# EAGLE design XM125_Breakout (EAGLE 9.6.2)
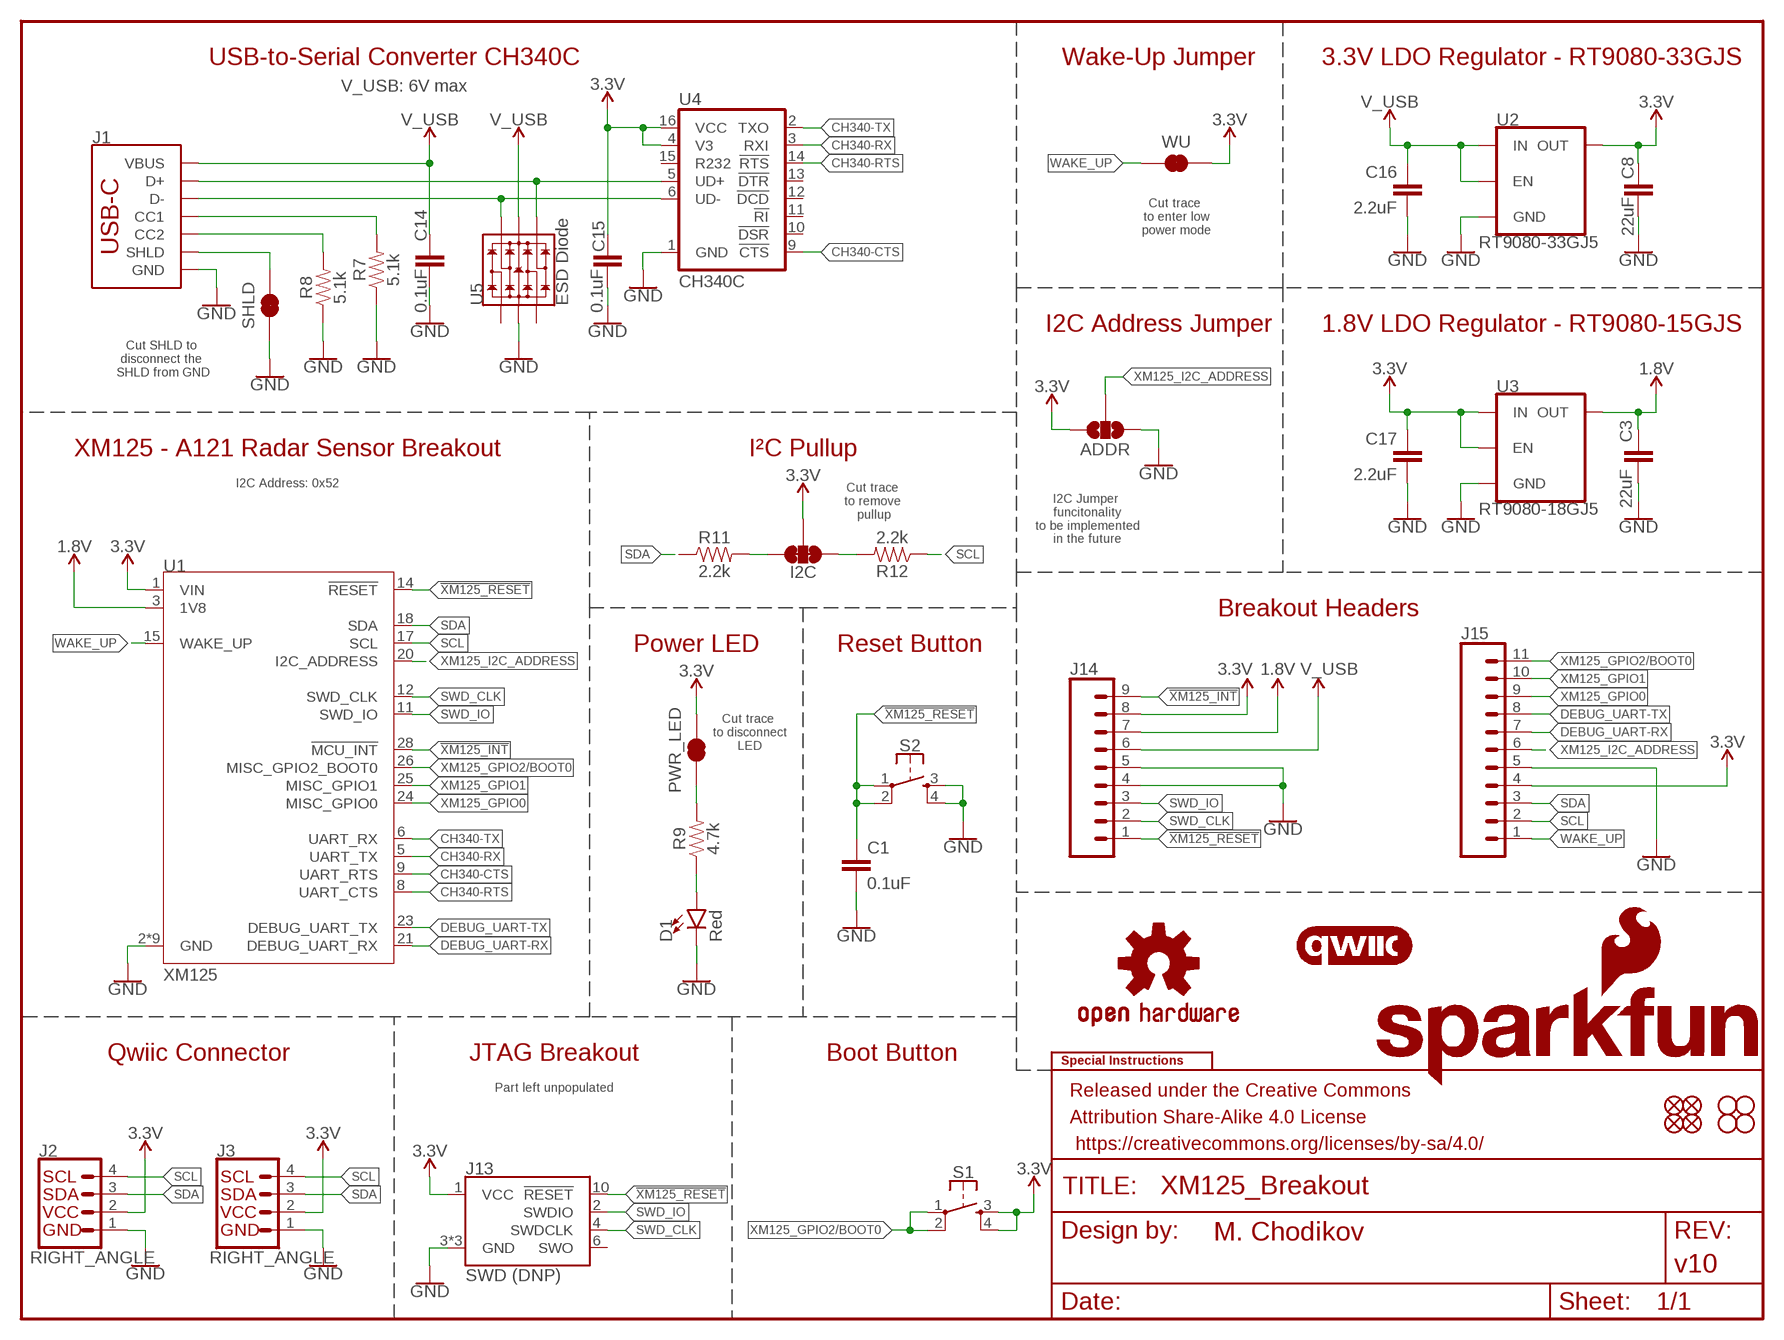
[diagram p0: schematic, sheet 1]

## Parts
ADDR  JUMPER-SMT_3_NO_SILK  [SMT-JUMPER_3_NO_SILK]
C1  0.1uF  0.1UF-0603-25V-(+80/-20%)  [0603]
C3  22uF  22UF-0603-6.3V-20%  [0603]
C8  22uF  22UF-0603-6.3V-20%  [0603]
C14  0.1uF  0.1UF-0603-25V-(+80/-20%)  [0603]
C15  0.1uF  0.1UF-0603-25V-(+80/-20%)  [0603]
C16  2.2uF  2.2UF-0603-10V-20%  [0603]
C17  2.2uF  2.2UF-0603-10V-20%  [0603]
D1  Red  LED-RED_0603-KB  [LED-0603]
FD1  FIDUCIAL1X2  [FIDUCIAL-1X2]
FD2  FIDUCIAL1X2  [FIDUCIAL-1X2]
FD3  FIDUCIAL1X2  [FIDUCIAL-1X2]
FD4  FIDUCIAL1X2  [FIDUCIAL-1X2]
FRAME2  FRAME-LETTER  [CREATIVE_COMMONS]
H1  STAND-OFF  [STAND-OFF]
H2  STAND-OFF  [STAND-OFF]
H3  STAND-OFF  [STAND-OFF]
H4  STAND-OFF  [STAND-OFF]
I2C  JUMPER-SMT_3_2-NC_TRACE_SILK  [SMT-JUMPER_3_2-NC_TRACE_SILK]
J1  USB_C_2-LAYER_PADS  [USB-C-16P-2LAYER-PADS]
J2  RIGHT_ANGLE  QWIIC_CONNECTORJS-1MM  [JST04_1MM_RA]
J3  RIGHT_ANGLE  QWIIC_CONNECTORJS-1MM  [JST04_1MM_RA]
J13  SWD (DNP)  CORTEX_JTAG_DEBUG_MINIMUM_SMD_UNSHROUDED_DNP_NO_PASTE  [2X5-SMD-UNSHROUDED_DNP_NO_PASTE]
J14  CONN_09NO_SILK  [1X09_NO_SILK]
J15  CONN_111X11_NO_SILK  [1X11_NO_SILK]
LOGO1  SPECIAL_INSTRUCTIONS-ORDERING  [ORDERING_INSTRUCTIONS]
LOGO2  QWIIC_LOGO_4MM  [QWIIC_4MM]
LOGO3  SFE_LOGO_NAME_FLAME.1_INCH  [SFE_LOGO_NAME_FLAME_.1]
LOGO4  OSHW-LOGOS  [OSHW-LOGO-S]
LOGO5  SFE_LOGO_FLAME.1_INCH  [SFE_LOGO_FLAME_.1]
LOGO6  SFE_LOGO_NAME_FLAME.1_INCH  [SFE_LOGO_NAME_FLAME_.1]
PWR_LED  JUMPER-SMT_2_NC_TRACE_SILK  [SMT-JUMPER_2_NC_TRACE_SILK]
R7  5.1k  5.1KOHM5.1KOHM-0603-1/10W-1%  [0603]
R8  5.1k  5.1KOHM5.1KOHM-0603-1/10W-1%  [0603]
R9  4.7k  4.7KOHM-0603-1/10W-1%  [0603]
R11  2.2k  2.2KOHM-0603-1/10W-1%  [0603]
R12  2.2k  2.2KOHM-0603-1/10W-1%  [0603]
S1  MOMENTARY-SWITCH-SPST-2-SMD-5.2MM  [TACTILE_SWITCH_SMD_5.2MM]
S2  MOMENTARY-SWITCH-SPST-2-SMD-5.2MM  [TACTILE_SWITCH_SMD_5.2MM]
SHLD  JUMPER-SMT_2_NC_TRACE_SILK  [SMT-JUMPER_2_NC_TRACE_SILK]
U1  XM125  [XM125_ACC]
U2  RT9080-33GJ5  V_REG_RT9080  [SOT23-5]
U3  RT9080-18GJ5  [SOT23-5]
U4  CH340C  [SO016]
U5  ESD Diode  TVS_DIODE_ARRAY_DT1042-04SO-7  [SOT-23-6]
WU  JUMPER-SMT_2_NC_TRACE_SILK  [SMT-JUMPER_2_NC_TRACE_SILK]

## Nets
1.8V: C3.1 J14.7 U1.3(1V8) U3.5(OUT)
3.3V: ADDR.3 C8.1 C15.1 C17.1 I2C.2 J2.2 J3.2 J13.1(VCC) J14.8 J15.4 PWR_LED.2 S1.3 S1.4 U1.1(VIN) U2.5(OUT) U3.1(IN) U3.3(EN) U4.4(V3) U4.16(VCC) WU.2
!XM125_INT: J14.9 U1.28(!MCU_INT)
!XM125_RESET: C1.2 J13.10(!RESET) J14.1 S2.1 S2.2 U1.14(!RESET)
CH340-CTS: U1.9(UART_RTS) U4.9(!CTS)
CH340-RTS: U1.8(UART_CTS) U4.14(!RTS)
CH340-RX: U1.5(UART_TX) U4.3(RXI)
CH340-TX: U1.6(UART_RX) U4.2(TXO)
DEBUG_UART-RX: J15.7 U1.21(DEBUG_UART_RX)
DEBUG_UART-TX: J15.8 U1.23(DEBUG_UART_TX)
GND: ADDR.1 C1.1 C3.2 C8.2 C14.2 C15.2 C16.2 C17.2 D1.C J1.GND J1.GND2(GND) J2.1 J3.1 J13.3(GND) J13.5(GND) J13.9(GND) J14.4 J14.5 J15.5 R7.1 R8.1 S2.3 S2.4 SHLD.1 U1.2(GND) U1.4(GND) U1.7(GND) U1.10(GND) U1.13(GND) U1.16(GND) U1.19(GND) U1.22(GND) U1.27(GND) U2.2(GND) U3.2(GND) U4.1(GND) U5.2(VSS)
N$1: J1.A6(D+) J1.B6(D+) U4.5(UD+) U5.4(IO3)
N$2: J1.A7(D-) J1.B7(D-) U4.6(UD-) U5.6(IO4)
N$9: J1.SHLD1(SHLD) J1.SHLD2(SHLD) J1.SHLD3(SHLD) J1.SHLD4(SHLD) SHLD.2
N$10: J1.B5(CC2) R8.2
N$11: J1.A5(CC1) R7.2
N$14: PWR_LED.1 R9.2
N$15: D1.A R9.1
N$16: I2C.3 R11.2
N$17: I2C.1 R12.2
SCL: J2.4 J3.4 J15.2 R12.1 U1.17(SCL)
SDA: J2.3 J3.3 J15.3 R11.1 U1.18(SDA)
SWD_CLK: J13.4(SWDCLK) J14.2 U1.12(SWD_CLK)
SWD_IO: J13.2(SWDIO) J14.3 U1.11(SWD_IO)
V_USB: C14.1 C16.1 J1.VBUS1(VBUS) J1.VBUS2(VBUS) J14.6 U2.1(IN) U2.3(EN) U5.5(VCC)
WAKE_UP: J15.1 U1.15(WAKE_UP) WU.1
XM125_GPIO0: J15.9 U1.24(MISC_GPIO0)
XM125_GPIO1: J15.10 U1.25(MISC_GPIO1)
XM125_GPIO2/BOOT0: J15.11 S1.1 S1.2 U1.26(MISC_GPIO2_BOOT0)
XM125_I2C_ADDRESS: ADDR.2 J15.6 U1.20(I2C_ADDRESS)
Unconnected: J13.6(SWO) U4.10(!DSR) U4.11(!RI) U4.12(!DCD) U4.13(!DTR) U4.15(R232) U5.1(IO1) U5.3(IO2)

## Notes on the sheet
- USB-to-Serial Converter CH340C | Wake-Up Jumper | 3.3V LDO Regulator - RT9080-33GJS
- V_USB: 6V max
- Cut trace 
  to enter low
  power mode
- I2C Address Jumper | 1.8V LDO Regulator - RT9080-15GJS
- Cut SHLD to 
  disconnect the 
  SHLD from GND
- XM125 - A121 Radar Sensor Breakout | I²C Pullup
- I2C Address: 0x52
- Cut trace 
  to remove 
  pullup
- I2C Jumper 
  funcitonality
  to be implemented
  in the future
- Breakout Headers
- Power LED | Reset Button
- Cut trace 
  to disconnect
  LED
- Qwiic Connector | JTAG Breakout | Boot Button
- Part left unpopulated

## Library data of the parts
ADDR = SparkFun-Jumpers:JUMPER-SMT_3_NO: Normally open jumper This jumper has three pads in close proximity to each other. Apply solder to close the connection(s).
C1 C14 C15 = SparkFun-Capacitors:0.1UF: 0.1µF ceramic capacitors A capacitor is a passive two-terminal electrical component used to store electrical energy temporarily in an electric field.; PROD_ID: CAP-00810
C3 C8 = SparkFun-Capacitors:22UF: 22µF ceramic capacitors A capacitor is a passive two-terminal electrical component used to store electrical energy temporarily in an electric field.; PROD_ID: CAP-14464
C16 C17 = SparkFun-Capacitors:2.2UF: 2.2µF ceramic capacitors A capacitor is a passive two-terminal electrical component used to store electrical energy temporarily in an electric field.; PROD_ID: CAP-07888
D1 = SparkFun-LED:LED-RED: Red SMD LED Used in manufacturing of most products at SparkFun Packages: 0603 - KB - KingBright (DIO-17976) SMD 0603 package [Datasheet] <https://www.kingbrightusa.com/images/catalog/SPEC/APT1608SURCK.pdf> 0603 - (DIO-00819, has gone EOL) SMD 0603 package 0603 SMART - SMD 0603 SMART package ( more efficient and expensive)[Product Link] <http://www.osram-os.com/Graphics/XPic2/00077099_0.pdf> 1206 - SMD1206 package [Product Link] <https://www.sparkfun.com/datasheets/DevTools/LilyPad/Q150OVS4.pdff> SparkFun Products: Pro Mini 328 -5V <https://www.sparkfun.com/products/821> RedBoard <https://www.sparkfun.com/products/12757> IOIO-OTG <https://www.sparkfun.com/products/13613>; PROD_ID: DIO-17976
FD1-FD4 = SparkFun-Aesthetics:FIDUCIAL: Fiducial Alignment Points Point-of-reference for pick-and-place machines and other optical instruments.
FRAME2 = SparkFun-Aesthetics:FRAME-LETTER: Schematic Frame - Letter Standard 8.5x11 US Letter frame; DESIGNER: M. Chodikov; REV: v10
H1-H4 = SparkFun-Hardware:STAND-OFF: Stand Off Drill holes for mechanically mounting via screws, standoffs, etc. Note: Use the keepout ring to avoid running the screw head into surrounding components. Variant Overviews STAND-OFF - Mechanical footprint for a #4 phillips button head screw. STAND-OFF-TIGHT - Mechanical footprint for a #4 phillips button head screw, Example SparkFun Products Screw - Phillips Head (1/4", 4-40, 10 pack) <https://www.sparkfun.com/products/10453> (PRT-10453) Screw - Phillips Head (1/2", 4-40, 10 pack) <https://www.sparkfun.com/products/10452> (PRT-10452) Screw - Phillips Head (3/4", 4-40, 10 pack) <https://www.sparkfun.com/products/10451> (PRT-10451) Screw - Phillips Head (1", 4-40, 10 pack) <https://www.sparkfun.com/products/10450> (PRT-10450)
I2C = SparkFun-Jumpers:JUMPER-SMT_3_2-NC_TRACE: Normally closed trace jumper (2 of 2 connections) This jumper has a trace between all three pads so they are normally closed (NC). Use a razor knife to open the connection(s). For best results follow the IPC guidelines for cutting traces: Cutout at least 0.063 mm (0.005 in). Remove all loose material to clean up the cut area. Seal the cut with an approved epoxy. Reapply solder to reclose the connection(s).
J1 = SparkFun-Connectors:USB_C: USB Type C 16Pin Connector Super Speed pins not available on the 16-pin purely SMD connector so this part is best for USB 2.0 implementations. D1 and D2 are tied together enabling D+/- no matter which way the cable is plugged into the connector. The two channel configuration pins (CC1/2) are exposed. These are normally connected to ground via 5.1k resistors but can be reconfigured for high current/high power applications. **4-LAYER BOARD WARNING!!** If designing 4-layer board, make sure to select the variant _4-LAYER-ISOLATED. The linked footprint (USB-C-16-4LAYER-ISOLATED) includes some very necessary cutout polygons in the inner layers (2 and 15). This prevents the PTH mounting shield legs on the USB connector from electrically connecting any other polygons on the inner layers (usually VCC and GND).; PROD_ID: CONN-14122
J2 J3 = SparkFun-Connectors:QWIIC_CONNECTOR: SparkFun I2C Standard Qwiic Connector An SMD 1mm pitch JST connector makes it easy and quick (get it? Qwiic?) to connect I2C devices to each other. The Qwiic system <http://www.sparkfun.com/qwiic> enables fast and solderless connection between popular platforms and various sensors and actuators. We carry 200mm <https://www.sparkfun.com/products/14204>, 100mm <https://www.sparkfun.com/products/14205>, 50mm <https://www.sparkfun.com/products/14206>, and breadboard friendly <https://www.sparkfun.com/products/14207> Qwiic cables. We also offer 10 pcs strips <https://www.sparkfun.com/products/14323> the SMD connectors.; PROD_ID: CONN-13694; VALUE: QWIIC_RIGHT_ANGLE
J13 = SparkFun-Connectors:CORTEX_JTAG_DEBUG_MINIMUM: Cortex Debug Connector - 10 pin Supports JTAG debug, Serial Wire debug, and Serial Wire Viewer. PTH and SMD connector options available. General Connector Information <http://infocenter.arm.com/help/topic/com.arm.doc.faqs/attached/13634/cortex_debug_connectors.pdf> Products: PTH Connector <http://www.digikey.com/product-detail/en/cnc-tech/3220-10-0100-00/1175-1627-ND/3883661> -via Digi-Key SparkFun PSoc <https://www.sparkfun.com/products/13229> SparkFun T <https://www.sparkfun.com/products/13810>
J14 = SparkFun-Connectors:CONN_09: Multi connection point. Often used as Generic Header-pin footprint for 0.1 inch spaced/style header connections On any of the 0.1 inch spaced packages, you can populate with these: Break Away Headers - Straight <https://www.sparkfun.com/products/116> (PRT-00116) Break Away Male Headers - Right Angle <https://www.sparkfun.com/products/553> (PRT-00553) Female Headers <https://www.sparkfun.com/products/115> (PRT-00115) Break Away Headers - Machine Pin <https://www.sparkfun.com/products/117> (PRT-00117) Break Away Female Headers - Swiss Machine Pin <https://www.sparkfun.com/products/743> (PRT-00743) For SCREWTERMINALS and SPRING TERMINALS visit here: Screw Terimnals on SparkFun.com <https://www.sparkfun.com/search/results?term=Screw+Terminals> (5mm/3.5mm/2.54mm spacing) This device is also useful as a general connection point to wire up your design to another part of your project. Our various solder wires solder well into these plated through hole pads. Hook-Up Wire - Assortment (Stranded, 22 AWG) <https://www.sparkfun.com/products/11375> (PRT-11375) Hook-Up Wire - Assortment (Solid Core, 22 AWG) <https://www.sparkfun.com/products/11367> (PRT-11367) View the entire wire category on our website here <https://www.sparkfun.com/categories/141> Special notes: Molex polarized connector foot print use with SKU : PRT-08231 with associated crimp pins and housings. 1MM SMD Version SKU: PRT-10208 NOTES ON THE VARIANTS LOCK and LOCK_LONGPADS... This footprint was designed to help hold the alignment of a through-hole component (i.e. 6-pin header) while soldering it into place. You may notice that each hole has been shifted either up or down by 0.005 of an inch from it's more standard position (which is a perfectly straight line). This slight alteration caused the pins (the squares in the middle) to touch the edges of the holes. Because they are alternating, it causes a "brace" to hold the component in place. 0.005 has proven to be the perfect amount of "off-center" position when using our standard breakaway headers. Although looks a little odd when you look at the bare footprint, once you have a header in there, the alteration is very hard to notice. Also,if you push a header all the way into place, it is covered up entirely on the bottom side.
J15 = SparkFun-Connectors:CONN_11: Multi connection point. Often used as Generic Header-pin footprint for 0.1 inch spaced/style header connections On any of the 0.1 inch spaced packages, you can populate with these: Break Away Headers - Straight <https://www.sparkfun.com/products/116> (PRT-00116) Break Away Male Headers - Right Angle <https://www.sparkfun.com/products/553> (PRT-00553) Female Headers <https://www.sparkfun.com/products/115> (PRT-00115) Break Away Headers - Machine Pin <https://www.sparkfun.com/products/117> (PRT-00117) Break Away Female Headers - Swiss Machine Pin <https://www.sparkfun.com/products/743> (PRT-00743) For SCREWTERMINALS and SPRING TERMINALS visit here: Screw Terimnals on SparkFun.com <https://www.sparkfun.com/search/results?term=Screw+Terminals> (5mm/3.5mm/2.54mm spacing) This device is also useful as a general connection point to wire up your design to another part of your project. Our various solder wires solder well into these plated through hole pads. Hook-Up Wire - Assortment (Stranded, 22 AWG) <https://www.sparkfun.com/products/11375> (PRT-11375) Hook-Up Wire - Assortment (Solid Core, 22 AWG) <https://www.sparkfun.com/products/11367> (PRT-11367) View the entire wire category on our website here <https://www.sparkfun.com/categories/141>
LOGO1 = SparkFun-Aesthetics:SPECIAL_INSTRUCTIONS: Special Ordering/Production Instructions Alert Symbol for special PCB ordering instructions or unique production process warnings. Ordering Instructions Production Instructions Types of information that should be added to box: Copper weight Soldermask color Silk color PCB thickness Number of layers PCB Standard: 1.6mm FR4 1 oz copper immersion silver plating red soldermask white silkscreen Types of information that should be added to box: Special wash requirements Depaneling instructions Humidification Glue curing Default text settings: 0.07 inch 9% ratio 50% line distance
LOGO2 = SparkFun-Aesthetics:QWIIC_LOGO: Qwiic Logos for placement on schematic and PCB. The 5.5mm silk logo is best for placing next to Qwiic connector.
LOGO3 LOGO6 = SparkFun-Aesthetics:SFE_LOGO_NAME_FLAME: SparkFun Font Logo w/ Flame This is the SparkFun full logo. The logo on the schematic will always be the same size; the package variant is the height of the flame part of the logo. Default layer for the logo on the board is tSilk.
LOGO4 = SparkFun-Aesthetics:OSHW-LOGO: Open-Source Hardware (OSHW) Logo This logo indicates the piece of hardware it is found on incorporates a OSHW license and/or adheres to the definition of open source hardware found here: http://freedomdefined.org/OSHW
LOGO5 = SparkFun-Aesthetics:SFE_LOGO_FLAME: SparkFun Flame Logo This is the SparkFun flame logo. The logo on the schematic will always be the same size; the package variant is the height of the flame. Default layer for the logo on the board is tSilk.
PWR_LED SHLD WU = SparkFun-Jumpers:JUMPER-SMT_2_NC_TRACE: Normally closed trace jumper This jumper has a trace between two pads so it's normally closed (NC). Use a razor knife to open the connection. For best results follow the IPC guidelines for cutting traces: Cutout at least 0.063 mm (0.005 in). Remove all loose material to clean up the cut area. Seal the cut with an approved epoxy. Reapply solder to reclose the connection.
R7 R8 = SparkFun-Resistors:5.1KOHM; PROD_ID: RES-12083
R9 = SparkFun-Resistors:4.7KOHM: 4.7kΩ resistor A resistor is a passive two-terminal electrical component that implements electrical resistance as a circuit element. Resistors act to reduce current flow, and, at the same time, act to lower voltage levels within circuits. - Wikipedia; PROD_ID: RES-07857
R11 R12 = SparkFun-Resistors:2.2KOHM: 2.2kΩ resistor A resistor is a passive two-terminal electrical component that implements electrical resistance as a circuit element. Resistors act to reduce current flow, and, at the same time, act to lower voltage levels within circuits. - Wikipedia; PROD_ID: RES-08272
S1 S2 = SparkFun-Switches:MOMENTARY-SWITCH-SPST-2: Momentary Switch (Pushbutton) - SPST - Two Circuits Normally-open (NO) SPST momentary switches (buttons, pushbuttons). Schematic symbol includes two switch circuits. Variants SMD-4.6MMX2.8MM - 4.60mm x 2.80mm Tactile Momentary Button Switch - Used on SparkFun Pro Micro - RP2040 <https://www.sparkfun.com/products/17717> SMD-5.2MM - Mini Pushbutton Switch - SMD <https://www.sparkfun.com/products/8720> - Used on Arduino Pro Mini <https://www.sparkfun.com/products/11114>; PROD_ID: SWCH-08247; SF_SKU: COM-08720
U1 = XM125:XM125: Acconeer XM125 The XM125 features the A121 Radar sensor. This sensor detects distance, speed, and objects up to 20 meters away. The XM125 features a longer range, lower power consumption and better accuracy for usage of the A121. SparkFun Products: Radar Breakout (XM125) <insert>; PROD_ID: SEN-21014
U2 = SparkFun-IC-Power:V_REG_RT9080; PROD_ID: VREG-19034
U3 = XM125:RT9080-18GJ5; PROD_ID: VREG-21045
U4 = SparkFun-IC-Comms:CH340C; PROD_ID: IC-14038
U5 = SparkFun-DiscreteSemi:TVS_DIODE_ARRAY; PROD_ID: IC-13538

## Board
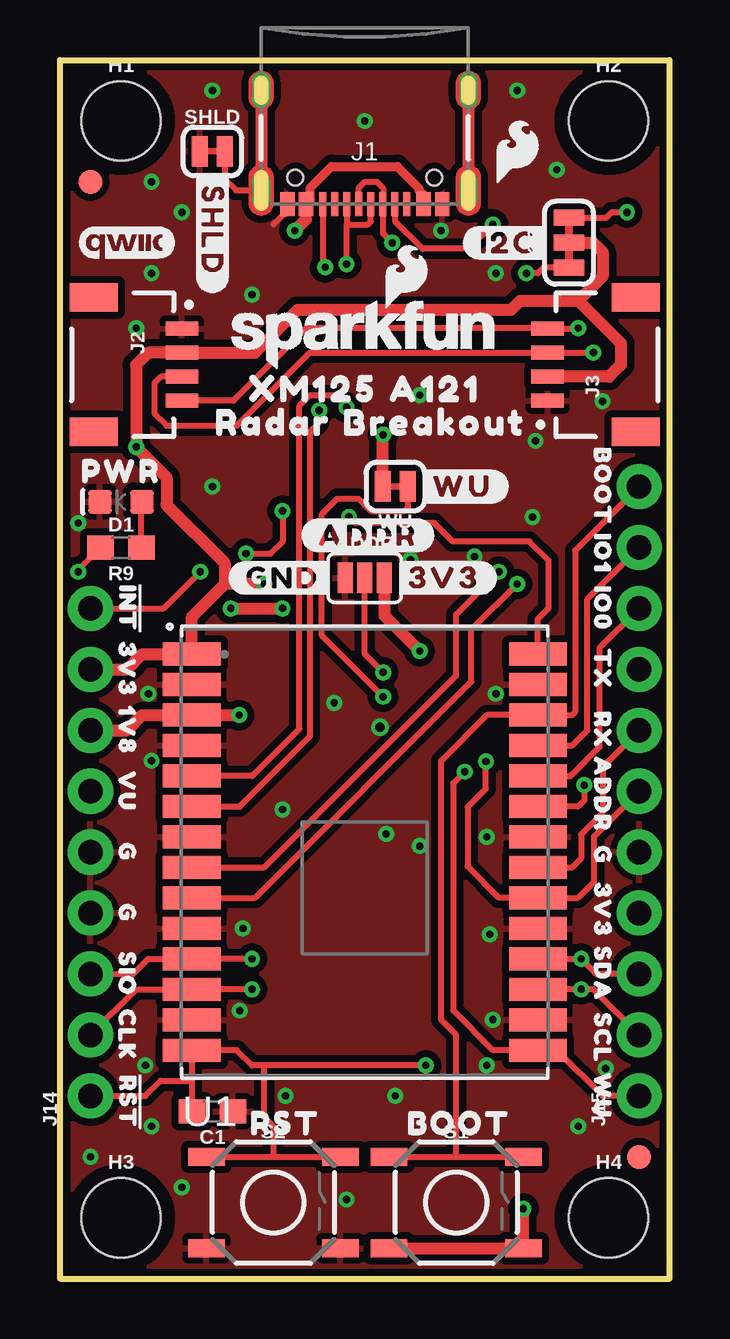
[diagram p1: board, top side]
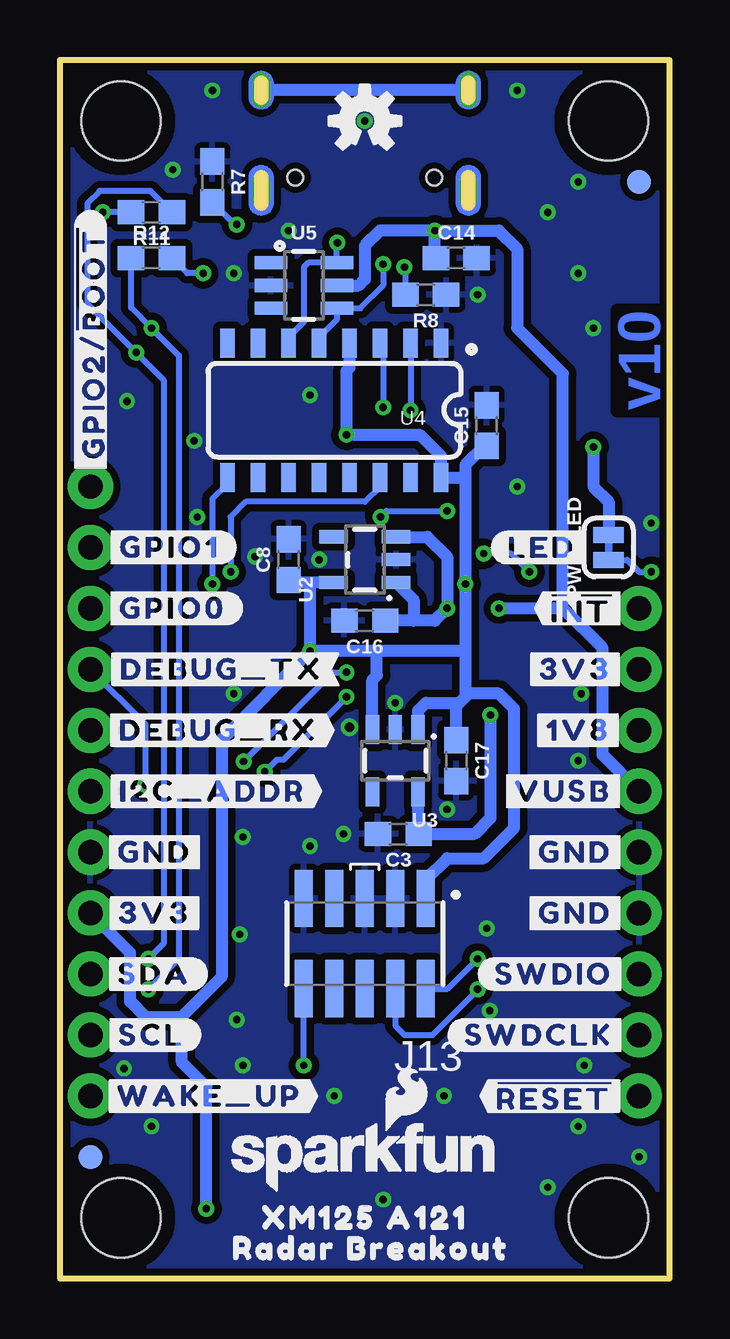
[diagram p2: board, bottom side, seen from below]

Size 25.4 x 50.8 mm. Coordinates in mm from the lower left corner, seen from the top.
Outline: 0,0 25.4,0 25.4,50.8 0,50.8 0,0
Copper layers (1*16): Top 0.035mm / dielectric 1.5mm / Bottom 0.035mm
Design rules "SparkFun-2-Layer-General-JLCPCB": minimum track width 7mil, minimum drill 0.3mm, track to track 7mil, track to pad 7mil, pad to pad 7mil, via to via 7mil, smd to smd 7mil, copper to edge 7mil, drill to drill 7mil, minimum pad ring 7mil, minimum via ring 7mil, stop-mask expansion 3mil, vias tented up to drill 25mil, thermal gap 10mil

### Footprints (pad centres in the part's own frame; a part is rotated, then mirrored left to right if it is on the bottom)
SMT-JUMPER_3_NO_SILK = smd 0.635 x 1.27: 1 -0.813,0; 2 0,0; 3 0.813,0
0603 = smd 1.1 x 1: 1 -0.85,0; 2 0.85,0
LED-0603 = smd 1 x 1: A -0.877,0; C 0.877,0
FIDUCIAL-1X2 = smd 1 x 1: 1 0,0
STAND-OFF = hole 3.302: 0,0
SMT-JUMPER_3_2-NC_TRACE_SILK = smd 0.66 x 1.27: 1 -1.041,0; 2 0,0; 3 1.041,0
USB-C-16P-2LAYER-PADS = smd 0.3 x 1: A5 -1.25,-0.34; A6 -0.25,-0.34; A7 0.25,-0.34; A8 1.25,-0.34; B5 1.75,-0.34; B6 0.75,-0.34; B7 -0.75,-0.34; B8 -1.75,-0.34 | smd 0.6 x 1: GND -3.225,-0.34; GND2 3.225,-0.34; VBUS1 -2.45,-0.34; VBUS2 2.45,-0.34 | drill 0.4 pad 0.6 long: SHLD1 -4.318,-0.915; SHLD2 4.318,-0.915; SHLD3 -4.318,-5.095; SHLD4 4.318,-5.095 | hole 0.65: -2.89,-1.445; 2.89,-1.445
JST04_1MM_RA = smd 0.6 x 1.35: 1 -1.5,0; 2 -0.5,0; 3 0.5,0; 4 1.5,0 | smd 1.2 x 2: NC1 2.8,-3.675; NC2 -2.8,-3.675
2X5-SMD-UNSHROUDED_DNP_NO_PASTE = smd 0.74 x 2.38: 1 -2.54,-1.88; 2 -2.54,1.88; 3 -1.27,-1.88; 4 -1.27,1.88; 5 0,-1.88; 6 0,1.88; 7 1.27,-1.88; 8 1.27,1.88; 9 2.54,-1.88; 10 2.54,1.88
1X09_NO_SILK = drill 1.016 pad 1.88: 1 0,0; 2 2.54,0; 3 5.08,0; 4 7.62,0; 5 10.16,0; 6 12.7,0; 7 15.24,0; 8 17.78,0; 9 20.32,0
1X11_NO_SILK = drill 1.016 pad 1.88: 1 0,0; 2 2.54,0; 3 5.08,0; 4 7.62,0; 5 10.16,0; 6 12.7,0; 7 15.24,0; 8 17.78,0; 9 20.32,0; 10 22.86,0; 11 25.4,0
SMT-JUMPER_2_NC_TRACE_SILK = smd 0.66 x 1.27: 1 -0.521,0; 2 0.521,0
TACTILE_SWITCH_SMD_5.2MM = smd 1.524 x 0.762: 1 -2.794,1.905; 2 2.794,1.905; 3 -2.794,-1.905; 4 2.794,-1.905
XM125_ACC = smd 2.4 x 0.95: 1 -7.21,8.255; 2 -7.21,6.985; 3 -7.21,5.715; 4 -7.21,4.445; 5 -7.21,3.175; 6 -7.21,1.905; 7 -7.21,0.635; 8 -7.21,-0.635; 9 -7.21,-1.905; 10 -7.21,-3.175; 11 -7.21,-4.445; 12 -7.21,-5.715; 13 -7.21,-6.985; 14 -7.21,-8.255; 15 7.21,-8.255; 16 7.21,-6.985; 17 7.21,-5.715; 18 7.21,-4.445; 19 7.21,-3.175; 20 7.21,-1.905; 21 7.21,-0.635; 22 7.21,0.635; 23 7.21,1.905; 24 7.21,3.175; 25 7.21,4.445; 26 7.21,5.715; 27 7.21,6.985; 28 7.21,8.255
SOT23-5 = smd 0.55 x 1.2: 1 -0.95,-1.3; 2 0,-1.3; 3 0.95,-1.3; 4 0.95,1.3; 5 -0.95,1.3
SO016 = smd 0.6 x 1.2: 1 -4.445,-2.8; 2 -3.175,-2.8; 3 -1.905,-2.8; 4 -0.635,-2.8; 5 0.635,-2.8; 6 1.905,-2.8; 7 3.175,-2.8; 8 4.445,-2.8; 9 4.445,2.8; 10 3.175,2.8; 11 1.905,2.8; 12 0.635,2.8; 13 -0.635,2.8; 14 -1.905,2.8; 15 -3.175,2.8; 16 -4.445,2.8
SOT-23-6 = smd 0.55 x 1.35: 1 -0.95,-1.375; 2 0,-1.375; 3 0.95,-1.375; 4 0.95,1.375; 5 0,1.375; 6 -0.95,1.375

### Placement (x,y rotation side)
ADDR  12.7,29.21 0 top
C1  6.35,6.99 180 top
C3  11.3,18.54 180 bottom
C8  15.88,29.97 90 bottom
C14  8.89,42.55 0 bottom
C15  7.62,35.56 90 bottom
C16  12.7,27.43 180 bottom
C17  8.89,21.59 270 bottom
D1  2.54,32.38 180 top
FD1  1.27,45.72 0 top
FD2  1.27,45.72 0 bottom
FD3  24.13,5.08 0 top
FD4  24.13,5.08 0 bottom
FRAME2  -15.24,-35.56 0 top  (outside the outline)
H1  2.54,48.26 0 top
H2  22.86,48.26 0 top
H3  2.54,2.54 0 top
H4  22.86,2.54 0 top
I2C  21.21,43.18 90 top
J1  12.7,44.45 180 top
J2  5.08,38.1 270 top
J3  20.32,38.1 90 top
J13  12.7,13.97 180 bottom
J14  1.27,7.62 90 top
J15  24.13,7.62 90 top
LOGO1  54.61,52.07 0 top  (outside the outline)
LOGO2  2.79,43.18 0 top
LOGO3  12.7,5.08 0 bottom
LOGO4  12.7,48.26 0 bottom
LOGO5  19.05,46.99 0 top
LOGO6  12.7,39.37 0 top
PWR_LED  2.54,30.48 90 bottom
R7  19.05,45.72 270 bottom
R8  10.16,41.02 180 bottom
R9  2.54,30.48 180 top
R11  21.59,44.45 180 bottom
R12  21.59,42.55 0 bottom
S1  16.51,3.17 0 top
S2  8.89,3.17 0 top
SHLD  6.35,46.99 0 top
U1  12.7,17.78 0 top
U2  12.7,29.97 90 bottom
U3  11.43,21.59 180 bottom
U4  13.97,36.2 180 bottom
U5  15.24,41.4 270 bottom
U$1  [#INT143]  2.92,27.94 270 top
U$2  [##INT#2]  3.68,27.94 0 bottom
U$3  [#LED#139]  5.33,30.48 0 bottom
U$4  [#GND#141]  3.94,17.78 0 bottom
U$5  [RST1630063003525]  9.4,6.48 0 top
U$6  [RX1152]  22.61,22.86 270 top
U$7  [#SWDIO#4]  4.83,12.7 0 bottom
U$8  [#VUSB#1]  4.45,20.32 0 bottom
U$9  [#3V3#17]  16,29.21 0 top
U$10  [#SCL#8]  21.59,10.16 0 bottom
U$11  [BOOT21630063003532]  16.64,6.48 0 top
U$12  [PWR21630063003533]  2.54,33.66 0 top
U$13  [#SDA#9]  21.46,12.7 0 bottom
U$14  [3V3144]  2.79,25.4 270 top
U$15  [1V8144]  2.79,22.86 270 top
U$16  [#1V8#141]  3.81,22.86 0 bottom
U$17  [RADAR_BREAKOUT1163]  12.45,1.27 0 bottom
U$18  [WU9]  22.61,7.62 270 top
U$19  [#RST6]  2.92,7.37 270 top
U$20  [#GPIO0#5]  20.7,27.94 0 bottom
U$21  [#GPIO1#5]  20.83,30.48 0 bottom
U$22  [#WU#14]  16.76,33.02 0 top
U$23  [#3V3#141]  3.94,25.4 0 bottom
U$24  [XM125_A1211163]  12.7,2.54 0 bottom
U$25  [#ADDR#16]  12.83,30.99 0 top
U$26  [#I2C#126]  18.67,43.18 0 top
U$27  [#GPIO2##BOOT#141]  24.13,38.99 90 bottom
U$28  [#DEBUG_RX#19]  18.8,22.86 0 bottom
U$29  [#SHLD#129]  6.35,43.69 270 top
U$30  [#GND#141]  3.94,15.24 0 bottom
U$31  [#GND#141]  21.46,17.78 0 bottom
U$32  [#3V3#141]  21.46,15.24 0 bottom
U$33  [3V3144]  22.61,15.37 270 top
U$34  [G144]  22.61,17.65 270 top
U$35  [G144]  2.79,17.78 270 top
U$36  [G144]  2.79,15.24 270 top
U$38  [VU146]  2.79,20.32 270 top
U$39  [IO0147]  22.61,27.94 270 top
U$40  [IO1148]  22.61,30.23 270 top
U$41  [BOOT1149]  22.61,33.02 270 top
U$42  [CLK1150]  2.79,10.16 270 top
U$43  [#SWDCLK#1151]  5.46,10.16 0 bottom
U$44  [TX1153]  22.61,25.4 270 top
U$45  [ADDR1154]  22.61,20.19 270 top
U$46  [SDA1155]  22.61,12.7 270 top
U$47  [SCL1157]  22.61,10.03 270 top
U$48  [#I2C_ADDR#12]  19.05,20.32 0 bottom
U$49  [SIO1159]  2.79,12.7 270 top
U$50  [#GND#17]  9.27,29.21 0 top
U$51  [#DEBUG_TX#18]  18.67,25.4 0 bottom
U$53  [RADAR_BREAKOUT1166]  12.95,35.69 0 top
U$54  [XM125_A1211167]  12.7,37.08 0 top
U$55  [#WAKE_UP#12]  19.18,7.62 0 bottom
U$56  [##RESET#13]  4.83,7.62 0 bottom
WU  13.97,33.02 180 top

### Tracks (layer width: path | path; a pad name or v marks a point on that pad's centre or on a via)
1.8V  (via drill 0.3)
  Top 0.508: v7.47,23.5 U1.3 3.43,23.5 2.79,22.86 J14.7
  Bottom 0.508: U3.5 10.48,18.57 C3.1 8.13,18.54 7.47,19.2 v7.47,23.5
3.3V  (via drill 0.3)
  Top 0.508: J3.2 22.87,37.6 23.37,38.1 23.37,38.99 21.59,40.77 | 21.59,40.77 19.18,40.77 18.8,40.39 9.91,40.39 8.12,38.6 J2.2 3.67,38.6 3.17,38.1 v3.17,34.67 4.45,33.4 4.45,32.26 6.86,29.84 6.86,28.96 | v8.51,28.96 6.86,28.96 | I2C.2 22.23,43.18 22.61,42.8 22.61,41.78 21.59,40.77 | 6.86,28.96 5.49,27.59 U1.1 3.43,26.04 2.79,25.4 J14.8 | v19.3,2.92 S1.4 S1.3 | WU.2 13.45,35.17 v13.46,35.18 | ADDR.3 13.51,27.64 v14.99,26.16
  Bottom 0.508: U2.5 14.99,29.02 | 14.99,29.02 15.78,29.02 C8.1 | C17.1 8.89,23.88 8.76,24 | 8.51,26.16 v8.51,28.96 8.51,33.4 | 8.51,26.16 8.51,24.38 | 8.51,24.38 8.51,24.26 8.76,24 | U4.4 13.34,37.97 13.46,37.85 v13.46,35.18 10.41,35.18 9.53,34.29 U4.16 8.51,33.4 | 8.51,33.4 8.51,33.91 7.71,34.71 C15.1 | 20.32,10.92 18.67,12.57 18.67,22.48 v14.99,26.16 | 20.32,10.92 21.84,10.92 22.48,11.56 22.48,13.59 J15.4 | 8.51,26.16 12.19,26.16 | 12.19,26.16 v14.99,26.16 | v3.17,34.67 3.17,33.02 2.54,32.38 PWR_LED.2 | J13.1 10.16,16.64 9.27,17.53 7.75,17.53 6.48,18.8 6.48,23.75 7.11,24.38 8.51,24.38 | U3.1 10.48,23.68 10.16,24 8.76,24 | 14.99,29.02 v14.99,26.16 | U3.3 12.38,24.96 12.19,25.15 12.19,26.16 | v19.3,2.92 19.3,8 20.32,9.02 20.32,10.92
!XM125_INT  (via drill 0.3)
  Top 0.254: v5.84,29.46 4.32,27.94 J14.9 | v7.75,30.23 8.76,30.23 9.27,30.73 v9.27,32 | v12.04,31.75 12.29,31.5 15.6,31.5 16.36,30.73 19.56,30.73 20.34,29.95 20.34,27.94 19.91,27.5 U1.28
  Bottom 0.254: v7.75,30.23 6.6,30.23 v5.84,29.46 | v12.04,31.75 11.79,32 v9.27,32
!XM125_RESET  (via drill 0.3)
  Top 0.254: 8.89,5.08 8.89,6.35 8.51,6.73 8.51,8.89 | S2.1 8.89,5.08 | 8.89,5.08 S2.2 | 5.49,8.26 U1.14 7.37,9.53 8,8.89 8.51,8.89 | 5.49,8.26 C1.2 | 5.49,8.26 4.19,8.26 3.56,7.62 J14.1 | v15.24,8.89 8.51,8.89
  Bottom 0.254: v15.24,8.89 J13.10
CH340-CTS  (via drill 0.3)
  Top 0.254: U1.9 8.13,15.88 17.14,24.89 17.14,27.05 v19.05,28.96
  Bottom 0.254: U4.9 18.41,33.15 19.05,32.51 v19.05,28.96
CH340-RTS  (via drill 0.3)
  Top 0.254: v18.29,29.46 16.51,27.69 16.51,25.15 8.51,17.14 U1.8
  Bottom 0.254: U4.14 12.06,33.02 12.7,32.38 17.65,32.38 18.29,31.75 v18.29,29.46
CH340-RX  (via drill 0.3)
  Top 0.254: U1.5 8,20.95 9.97,22.92 9.97,36.39 10.41,36.83 11.43,36.83 v11.94,36.32
  Bottom 0.254: U4.3 11.94,38.87 v11.94,36.32
CH340-TX  (via drill 0.3)
  Top 0.254: U1.6 7.49,19.68 10.41,22.61 10.41,35.31 10.79,35.69 v10.79,36.2
  Bottom 0.254: U4.2 v10.79,36.2
DEBUG_UART-RX
  Top 0.254: U1.21 21.34,17.14 21.72,17.53 21.72,18.52 22.61,19.41 22.61,21.34 J15.7
DEBUG_UART-TX  (via drill 0.3)
  Top 0.254: v21.84,20.57 21.84,19.94 21.59,19.68 U1.23
  Bottom 0.254: J15.8 21.84,23.11 v21.84,20.57
GND  (via drill 0.3, 0.38)
  Top 0.254: J1.GND2 9.47,44.53 8.89,43.94
  other vias: 3.81,45.72 8,41.02 15.88,43.69 18.16,41.91 19.81,34.92 14.61,29.97 0.76,31.5 9.27,19.56 3.81,6.35 1.27,5.08 17.78,8.89 5.08,3.81 11.94,3.3 13.97,7.62 9.4,7.62 18.03,10.79 7.49,11.18 7.62,14.61 18.16,24.38 5.08,44.45 6.35,49.53 19.05,49.53 19.68,31.75 20.7,46.23 17.91,14.35 13.59,18.54 12.7,48.26 21.59,6.35 3.56,8.89 3.81,41.91 22.73,8.76 3.68,24.38 3.81,21.59 3.17,39.62 22.61,36.58 14.99,18.03 11.43,24 17.27,30.1 17.78,18.41 14.99,36.83 6.35,33.02 13.34,22.99
  pour Bottom (isolate 0.305): 0,0 25.4,0 25.4,50.8 0,50.8
  pour Top (isolate 0.305): 0,0 25.4,0 25.4,50.8 0,50.8
N$1  (via drill 0.3)
  Top 0.254: J1.B6 11.95,44.06 12.06,43.94 | 12.06,43.94 11.94,43.94 v11.94,42.29 | 12.06,43.94 12.83,43.94 12.95,44.07 J1.A6
  Bottom 0.254: v11.94,42.29 11.94,41.4 12.89,40.45 U5.4 13.87,39.98 14.61,39.24 U4.5
N$2  (via drill 0.3)
  Top 0.254: J1.A7 12.45,45.47 12.7,45.72 13.21,45.72 13.46,45.47 13.46,44.8 J1.B7 13.45,43.57 v13.84,43.18
  Bottom 0.254: U4.6 15.88,39.24 15.24,39.88 15.24,42.16 15.05,42.35 U5.6 13.87,43.16 v13.84,43.18
N$9
  Top 0.254: J1.SHLD2 7.34,45.37 6.87,45.83 SHLD.2
  Top 0.508: J1.SHLD3 J1.SHLD1 | J1.SHLD4 J1.SHLD2
  Bottom 0.508: J1.SHLD4 J1.SHLD3
N$10  (via drill 0.3)
  Top 0.254: J1.B5 10.95,42.26 v11.05,42.16
  Bottom 0.254: v11.05,42.16 11.01,42.12 R8.2
N$11  (via drill 0.3)
  Top 0.254: J1.A5 13.95,44.09 15.11,42.93 17.02,42.93 v18.03,43.94
  Bottom 0.254: R7.2 18.12,43.94 v18.03,43.94
N$14  (via drill 0.3)
  Top 0.254: R9.2 0.76,29.55 v0.76,29.46
  Bottom 0.254: v0.76,29.46 1.27,29.46 1.76,29.96 PWR_LED.1
N$15
  Top 0.254: R9.1 3.39,32.36 D1.A
N$16  (via drill 0.3)
  Top 0.254: I2C.3 22.76,44.22 22.99,44.45 v23.62,44.45
  Bottom 0.254: R11.2 v23.62,44.45
N$17  (via drill 0.3)
  Top 0.254: v19.43,41.91 19.91,41.91 20.14,42.14 I2C.1
  Bottom 0.254: R12.2 20.11,41.91 v19.43,41.91
SCL  (via drill 0.3)
  Top 0.254: J2.4 7.23,36.6 10.25,39.62 20.3,39.62 J3.4 21.57,39.6 v21.59,39.62 | U1.17 v21.72,12.06 22.23,12.06 J15.2
  Bottom 0.254: R12.1 22.44,40.47 v21.59,39.62 20.45,38.48 20.45,13.34 v21.72,12.06
SDA  (via drill 0.3)
  Top 0.254: J2.3 4.2,37.6 3.94,37.34 3.94,36.07 4.45,35.56 7.37,35.56 10.41,38.6 J3.3 22.22,38.6 v22.23,38.61 | U1.18 v21.72,13.34 22.35,12.7 J15.3
  Bottom 0.254: R11.1 21.63,45.34 23.75,45.34 24.26,44.83 24.26,40.64 v22.23,38.61 21.08,37.47 21.08,13.97 v21.72,13.34
SWD_CLK  (via drill 0.3)
  Top 0.254: v8,12.06 U1.12 3.17,12.06 J14.2
  Bottom 0.254: J13.4 11.43,10.54 11.05,10.16 9.88,10.16 8,12.04 v8,12.06
SWD_IO  (via drill 0.3)
  Top 0.254: v8,13.34 U1.11 3.68,13.34 3.05,12.7 J14.3
  Bottom 0.254: J13.2 9.25,12.09 v8,13.34
V_USB  (via drill 0.3)
  Top 0.381: J1.VBUS1 15.15,45.17 14.97,45.35 14.97,45.44 14.06,46.35 11.3,46.35 10.43,45.48 10.43,44.97 J1.VBUS2 10.25,44.15
  Top 0.508: v9.78,43.69 9.95,43.86 10.25,44.15 | v7.11,27.94 v9.27,27.94
  Bottom 0.254: C14.1 9.78,42.58
  Bottom 0.508: 9.78,42.58 v9.78,43.69 | v9.78,43.69 7.11,43.69 6.35,42.93 6.35,39.62 4.45,37.72 4.45,27.94 | 4.45,27.94 v7.11,27.94 | 10.67,27.43 9.78,27.43 v9.27,27.94 9.27,30.1 10.09,30.92 U2.3 | 10.67,27.43 C16.1 | U2.1 10.67,28.29 10.67,27.43 | v9.78,43.69 12.06,43.69 12.7,43.05 12.7,41.66 12.95,41.4 U5.5 | 4.45,27.94 2.79,26.29 2.79,21.84 J14.6
WAKE_UP  (via drill 0.3)
  Top 0.254: v16.87,21.13 16.38,20.65 16.38,11.18 18.03,9.53 U1.15 20.7,9.53 22.61,7.62 J15.1 | WU.1 14.49,32.14 14.35,32 12.95,32 12.45,32.51 11.56,32.51 10.91,31.86 10.91,26.81 v13.46,24.26
  Bottom 0.254: v16.87,21.13 16.36,21.64 16.08,21.64 v13.46,24.26
XM125_GPIO0
  Top 0.254: U1.24 21.27,20.95 22.48,22.16 22.48,26.29 J15.9
XM125_GPIO1
  Top 0.254: U1.25 21.34,22.23 21.97,22.86 21.97,28.32 J15.10
XM125_GPIO2/BOOT0
  Top 0.254: S1.1 16.51,5.08 | 16.51,5.08 S1.2 | 16.51,5.08 16.51,10.16 15.88,10.79 15.88,21.59 17.78,23.5 U1.26 21.34,23.5 21.46,23.62 21.46,30.35 J15.11
XM125_I2C_ADDRESS  (via drill 0.3)
  Top 0.254: v17.75,21.56 17.75,20.42 16.99,19.65 16.99,17.18 18.29,15.88 U1.20 21.59,15.88 22.25,16.54 22.25,18.44 J15.6 | v13.46,25.27 12.7,26.04 ADDR.2
  Bottom 0.254: v17.75,21.56 14.04,25.27 v13.46,25.27

### Text on the board
Bottom: v10
Measures: Units: inches
tDocu: Solder Mask: Red / Thickness: 1.6mm / Two layer design / Finish: HASL Lead-Free / Copper Weight: 1oz / Material: TG135-140 | M. Chodikov